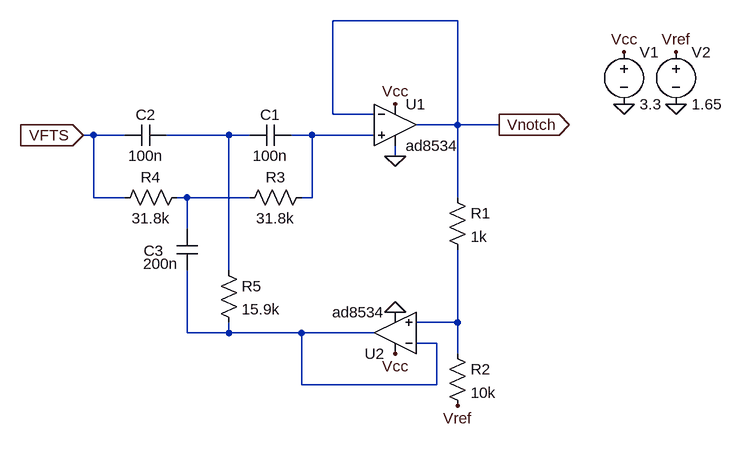
[diagram p0: schematic NOTCH50.asc]
NOTCH50.asc, the LTspice schematic file:
Version 4.1
SHEET 1 888 680
WIRE 480 -128 288 -128
WIRE 288 16 288 -128
WIRE 352 16 288 16
WIRE 480 32 480 -128
WIRE 480 32 416 32
WIRE 544 32 480 32
WIRE -80 48 -96 48
WIRE -32 48 -80 48
WIRE 128 48 32 48
WIRE 160 48 128 48
WIRE 256 48 224 48
WIRE 352 48 256 48
WIRE 384 80 384 64
WIRE -80 144 -80 48
WIRE -32 144 -80 144
WIRE 64 144 48 144
WIRE 160 144 64 144
WIRE 256 144 256 48
WIRE 256 144 240 144
WIRE 480 144 480 32
WIRE 64 192 64 144
WIRE 128 256 128 48
WIRE 480 336 480 224
WIRE 480 336 416 336
WIRE 64 352 64 256
WIRE 128 352 128 336
WIRE 128 352 64 352
WIRE 240 352 128 352
WIRE 352 352 240 352
WIRE 448 368 416 368
WIRE 480 384 480 336
WIRE 240 432 240 352
WIRE 448 432 448 368
WIRE 448 432 240 432
FLAG 384 80 0
FLAG 384 0 Vcc
FLAG 544 32 Vnotch
IOPIN 544 32 Out
FLAG 480 464 Vref
FLAG 384 384 Vcc
FLAG 384 320 0
FLAG -96 48 VFTS
IOPIN -96 48 In
FLAG 816 0 0
FLAG 736 0 0
FLAG 736 -80 Vcc
FLAG 816 -80 Vref
SYMBOL OpAmps\\opamp2 384 -32 R0
SYMATTR InstName U1
SYMATTR Value ad8534
SYMBOL res 464 128 R0
SYMATTR InstName R1
SYMATTR Value 1k
SYMBOL res 464 368 R0
SYMATTR InstName R2
SYMATTR Value 10k
SYMBOL cap 224 32 R90
WINDOW 0 0 32 VBottom 2
WINDOW 3 32 32 VTop 2
SYMATTR InstName C1
SYMATTR Value 100n
SYMBOL cap 32 32 R90
WINDOW 0 0 32 VBottom 2
WINDOW 3 32 32 VTop 2
SYMATTR InstName C2
SYMATTR Value 100n
SYMBOL res 256 128 R90
WINDOW 0 0 56 VBottom 2
WINDOW 3 32 56 VTop 2
SYMATTR InstName R3
SYMATTR Value 31.8k
SYMBOL res 64 128 R90
WINDOW 0 0 56 VBottom 2
WINDOW 3 32 56 VTop 2
SYMATTR InstName R4
SYMATTR Value 31.8k
SYMBOL cap 48 192 R0
WINDOW 0 -51 34 Left 2
WINDOW 3 -52 54 Left 2
SYMATTR InstName C3
SYMATTR Value 200n
SYMBOL res 112 240 R0
SYMATTR InstName R5
SYMATTR Value 15.9k
SYMBOL OpAmps\\opamp2 384 416 R180
SYMATTR InstName U2
SYMATTR Value ad8534
SYMBOL voltage 736 -96 R0
SYMATTR InstName V1
SYMATTR Value 3.3
SYMBOL voltage 816 -96 R0
WINDOW 123 0 0 Left 0
WINDOW 39 0 0 Left 0
SYMATTR InstName V2
SYMATTR Value 1.65

The netlist it stands for:
* NOTCH50.asc
X§U1 N002 Vnotch Vcc 0 Vnotch ad8534  ; pins In+ In- V+ V- OUT
R1 Vnotch N004 1k
R2 N004 Vref 10k
C1 N002 N001 100n
C2 N001 VFTS 100n
R3 N002 N003 31.8k
R4 N003 VFTS 31.8k
C3 N003 N005 200n
R5 N001 N005 15.9k
X§U2 N004 N005 Vcc 0 N005 ad8534  ; pins In+ In- V+ V- OUT
V1 Vcc 0 3.3
V2 Vref 0 1.65
.backanno
.end